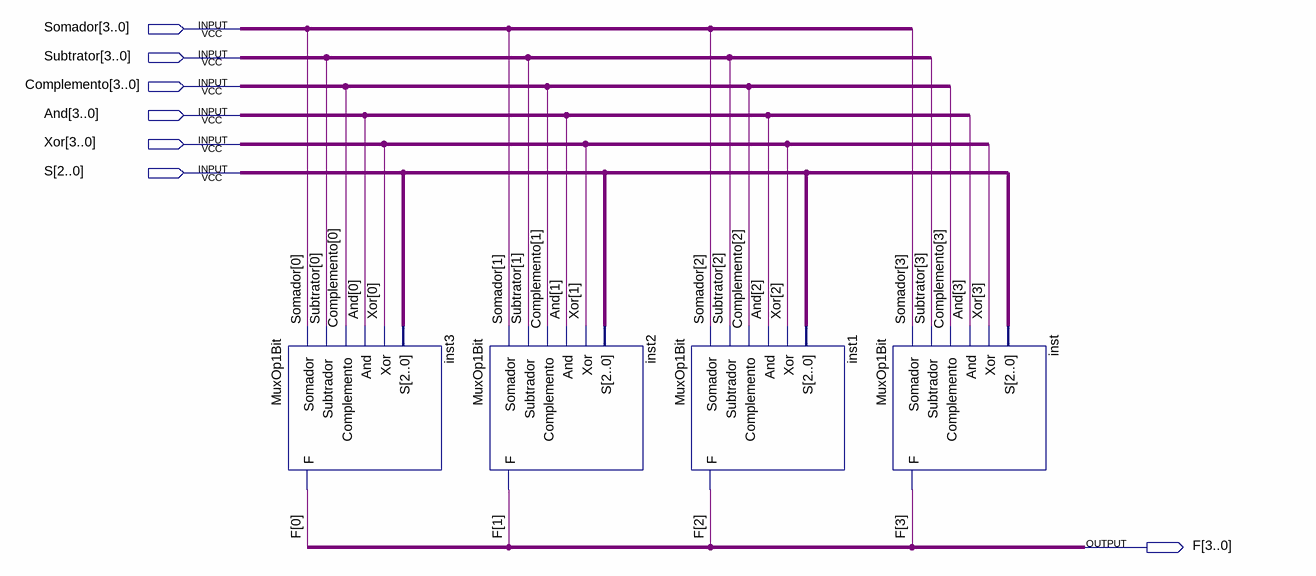
[diagram p0: schematic sheet]
// Quartus schematic MuxOp4Bits.bdf as structural Verilog: 4 symbols, 7 pins
module MuxOp4Bits (
  input  [3:0] Somador,
  input  [3:0] Subtrator,
  input  [3:0] Complemento,
  input  [3:0] And,
  input  [3:0] Xor,
  input  [2:0] S,
  output [3:0] F
);

  MuxOp1Bit inst3 (
    .Somador(Somador[0]), .Subtrador(Subtrator[0]), .Complemento(Complemento[0]), .And(And[0]), .Xor(Xor[0]),
    .S(S), .F(F[0]));
  MuxOp1Bit inst2 (
    .Somador(Somador[1]), .Subtrador(Subtrator[1]), .Complemento(Complemento[1]), .And(And[1]), .Xor(Xor[1]),
    .S(S), .F(F[1]));
  MuxOp1Bit inst1 (
    .Somador(Somador[2]), .Subtrador(Subtrator[2]), .Complemento(Complemento[2]), .And(And[2]), .Xor(Xor[2]),
    .S(S), .F(F[2]));
  MuxOp1Bit inst (
    .Somador(Somador[3]), .Subtrador(Subtrator[3]), .Complemento(Complemento[3]), .And(And[3]), .Xor(Xor[3]),
    .S(S), .F(F[3]));
endmodule
